# EAGLE design circuit (EAGLE 6.4)
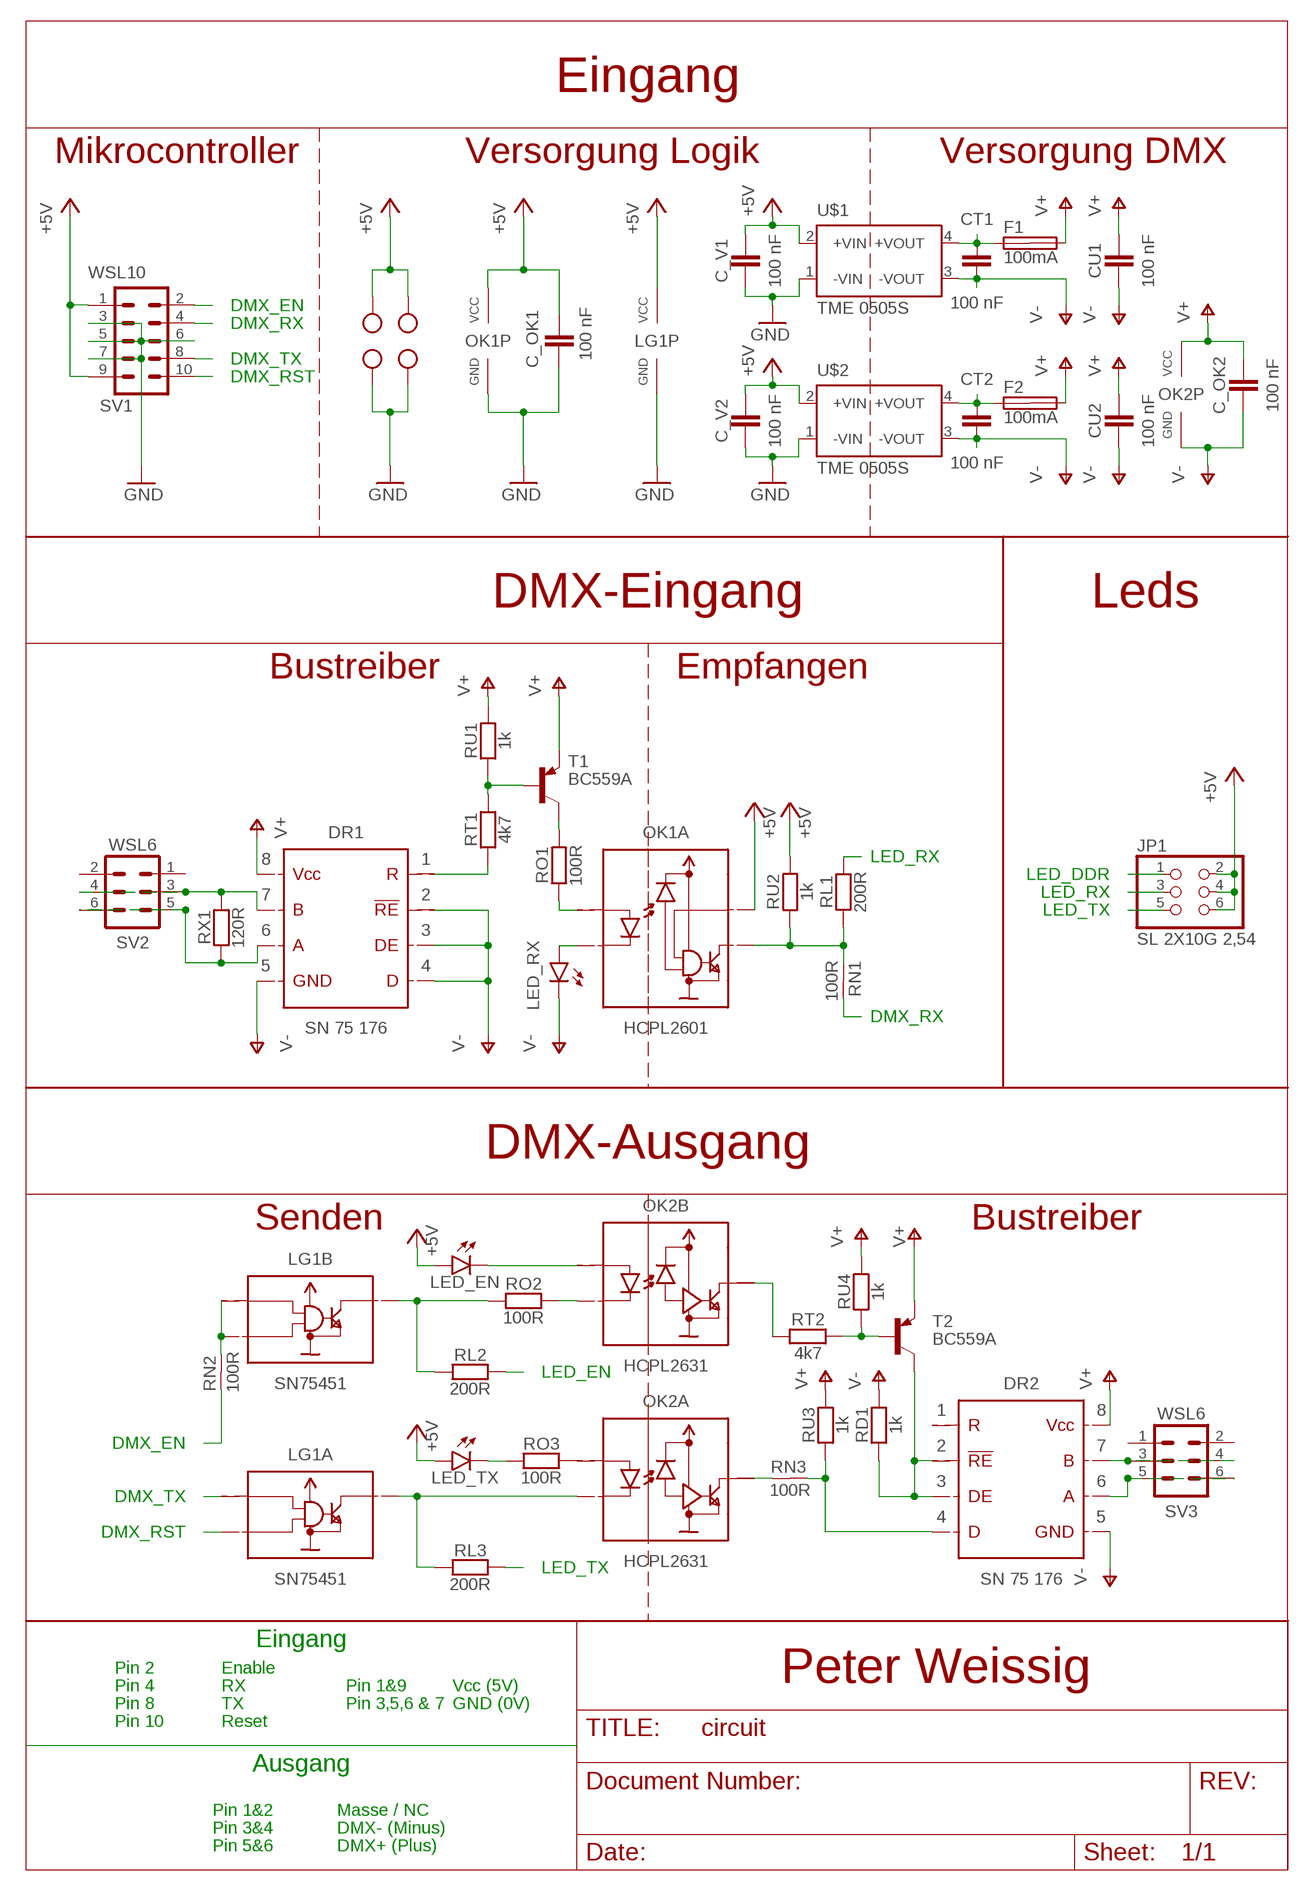
[diagram p0: schematic, sheet 1]

## Parts
C_OK1  100 nF  CAPACITATOR-2,5MM  [C_THT_2]
C_OK2  100 nF  CAPACITATOR-2,5MM  [C_THT_2]
C_V1  100 nF  CAPACITATOR-2,5MM  [C_THT_2]
C_V2  100 nF  CAPACITATOR-2,5MM  [C_THT_2]
CT1  100 nF  CAPACITATOR-2,5MM  [C_THT_2]
CT2  100 nF  CAPACITATOR-2,5MM  [C_THT_2]
CU1  100 nF  CAPACITATOR-2,5MM  [C_THT_2]
CU2  100 nF  CAPACITATOR-2,5MM  [C_THT_2]
DR1  SN75 176  DRIVER_RS485  [IC_DIL08]
DR2  SN75 176  DRIVER_RS485  [IC_DIL08]
F1  100mA  SHK20L  [SHK20L]
F2  100mA  SHK20L  [SHK20L]
JP1  SL 2X10G 2,54  PINHD-2X3  [2X03]
LED_EN  LED-3MM  [LED_3MM]
LED_RX  LED-3MM  [LED_3MM]
LED_TX  LED-3MM  [LED_3MM]
LG1  SN75451  LOGIK_AND_SN75451OUT  [IC_DIL08_OUT]
OK1  HCPL2601  COUPLER_HCPL2601OUT  [IC_DIL08_OUT]
OK2  HCPL2631  COUPLER_HCPL2631OUT  [IC_DIL08_OUT]
RD1  1k  RESISTOR-10MM  [R_THT_4]
RL1  200R  RESISTOR-10MM  [R_THT_4]
RL2  200R  RESISTOR-10MM  [R_THT_4]
RL3  200R  RESISTOR-10MM  [R_THT_4]
RN1  100R  BRIDGE-10MM  [R_THT_4]
RN2  100R  BRIDGE-10MM  [R_THT_4]
RN3  100R  BRIDGE-10MM  [R_THT_4]
RO1  100R  RESISTOR-10MM  [R_THT_4]
RO2  100R  RESISTOR-10MM  [R_THT_4]
RO3  100R  RESISTOR-10MM  [R_THT_4]
RT1  4k7  RESISTOR-10MM  [R_THT_4]
RT2  4k7  RESISTOR-10MM  [R_THT_4]
RU1  1k  RESISTOR-10MM  [R_THT_4]
RU2  1k  RESISTOR-10MM  [R_THT_4]
RU3  1k  RESISTOR-10MM  [R_THT_4]
RU4  1k  RESISTOR-10MM  [R_THT_4]
RX1  120R  RESISTOR-10MM  [R_THT_4]
SV1  WSL10  STECKER_WANNE_10  [STECKER_WANNE_10]
SV2  WSL6  STECKER_WANNE_6  [STECKER_WANNE_6]
SV3  WSL6  STECKER_WANNE_6  [STECKER_WANNE_6]
T1  BC559A  [TO92-EBC]
T2  BC559A  [TO92-EBC]
U$1  TME 0505S  TRACO_TME_1  [TRACO_TME_1]
U$2  TME 0505S  TRACO_TME_1  [TRACO_TME_1]
X1  AKL101-2  W237-102  [W237-102]
X2  AKL101-2  W237-102  [W237-102]

## Nets
+5V: C_OK1.1 C_V1.1 C_V2.1 JP1.2 JP1.4 JP1.6 LED_EN.A LED_TX.A LG1.8(P:VCC) OK1.7(A:I_EN) OK1.8(P:VCC) RU2.2 SV1.1 SV1.9 U$1.2(+VIN) U$2.2(+VIN) X1.1 X2.2
DMX_DDR_1_O1: DR2.2 DR2.3 RD1.2 T2.C
DMX_EN: RN2.2 SV1.2
DMX_N_1: DR1.7 RX1.1 SV2.3 SV2.4
DMX_N_2: DR2.7 SV3.3 SV3.4
DMX_P_1: DR1.6 RX1.2 SV2.5 SV2.6
DMX_P_2: DR2.6 SV3.5 SV3.6
DMX_READ_1_O: DR1.1 RT1.2
DMX_RST: LG1.2(A:I_2) SV1.10
DMX_RX: RN1.1 SV1.4
DMX_TX: LG1.1(A:I_1) SV1.8
GND: C_OK1.2 C_V1.2 C_V2.2 LG1.4(P:GND) OK1.5(P:GND) SV1.3 SV1.5 SV1.6 SV1.7 U$1.1(-VIN) U$2.1(-VIN) X1.2 X2.1
GND_RX: CT1.2 CU1.2 DR1.2 DR1.3 DR1.4 DR1.5 LED_RX.K(C) U$1.3(-VOUT) ; supply symbol labelled V-
GND_TX: C_OK2.1 CT2.2 CU2.2 DR2.5 OK2.5(P:GND) RD1.1 U$2.3(-VOUT) ; supply symbol labelled V-
LED_EN: JP1.1 RL2.2
LED_RX: JP1.3 RL1.1
LED_TX: JP1.5 RL3.2
N$1: OK1.6(A:O) RL1.2 RN1.2 RU2.1
N$2: OK2.6(B:O) RT2.2
N$4: OK2.7(A:O) RN3.2
N$5: DR2.4 RN3.1 RU3.2
N$6: RT1.1 RU1.2 T1.B
N$7: RT2.1 RU4.2 T2.B
N$8: LG1.3(A:O) OK2.2(A:I_K) RL3.1
N$9: OK2.1(A:I_A) RO3.2
N$10: OK2.3(B:I_K) RO2.2
N$11: LED_TX.K(C) RO3.1
N$13: CT1.1 F1.1A U$1.4(+VOUT)
N$15: LG1.5(B:O) RL2.1 RO2.1
N$27: LED_EN.K(C) OK2.4(B:I_A)
N$28: LED_RX.A OK1.3(A:I_K)
N$29: OK1.2(A:I_A) RO1.1
N$30: RO1.2 T1.C
N$39: CT2.1 F2.1A U$2.4(+VOUT)
N$_14: LG1.6(B:I_1) LG1.7(B:I_2) RN2.1
VCC_RX: CU1.1 DR1.8 F1.2A RU1.1 T1.E ; supply symbol labelled V+
VCC_TX: C_OK2.2 CU2.1 DR2.8 F2.2A OK2.8(P:VCC) RU3.1 RU4.1 T2.E ; supply symbol labelled V+
Unconnected: DR2.1 F1.1B F1.2B F2.1B F2.2B SV2.1 SV2.2 SV3.1 SV3.2

## Notes on the sheet
- Eingang
- Mikrocontroller | Versorgung Logik | Versorgung DMX
- DMX_EN
- DMX_RX
- DMX_TX
- DMX_RST
- DMX-Eingang | Leds
- Bustreiber | Empfangen
- LED_RX
- LED_DDR
- LED_RX
- LED_TX
- DMX_RX
- DMX-Ausgang
- Senden | Bustreiber
- LED_EN
- DMX_EN
- DMX_TX
- DMX_RST
- LED_TX
- Eingang
- Pin 2 | Enable
- Peter Weissig
- Pin 4 | RX | Pin 1&9 | Vcc (5V)
- Pin 8 | TX | Pin 3,5,6 & 7 | GND (0V)
- Pin 10 | Reset
- Ausgang
- Pin 1&2 | Masse / NC
- Pin 3&4 | DMX- (Minus)
- Pin 5&6 | DMX+ (Plus)

## Library data of the parts
C_OK1 C_OK2 C_V1 C_V2 CT1 CT2 CU1 CU2 = robo_ag:CAPACITATOR: Kondensator
DR1 DR2 = robo_ag:DRIVER_RS485: RS485-Treiber
F1 F2 = fuse:SHK20L: FUSE HOLDER 5 x 20 mm, SH contact, SHH1 Schukat, E1073 Buerklin; OC_FARNELL: unknown; OC_NEWARK: unknown
JP1 = pinhead:PINHD-2X3: PIN HEADER
LED_EN LED_RX LED_TX = robo_ag:LED: Led
LG1 = robo_ag:LOGIK_AND_SN75451
OK1 = robo_ag:COUPLER_HCPL2601: Optokoppler; REICHELT: HCPL 2601
OK2 = robo_ag:COUPLER_HCPL2631: Optokoppler; REICHELT: HCPL 2631
RD1 RL1-RL3 RO1-RO3 RT1 RT2 RU1-RU4 RX1 = robo_ag:RESISTOR: Widerstand
RN1-RN3 = robo_ag:BRIDGE: Widerstand
SV1 = robo_ag:STECKER_WANNE_10: Stecker; REICHELT: WSL 10G
SV2 SV3 = robo_ag:STECKER_WANNE_6: Stecker; REICHELT: WSL 6G
T1 T2 = transistor-pnp:BC559*: PNP Transistror
U$1 U$2 = robo_ag:TRACO_TME_1
X1 X2 = con-wago-500:W237-102: WAGO SCREW CLAMP; MPN: 237-102; OC_FARNELL: unknown; OC_NEWARK: 70K9898

## Board
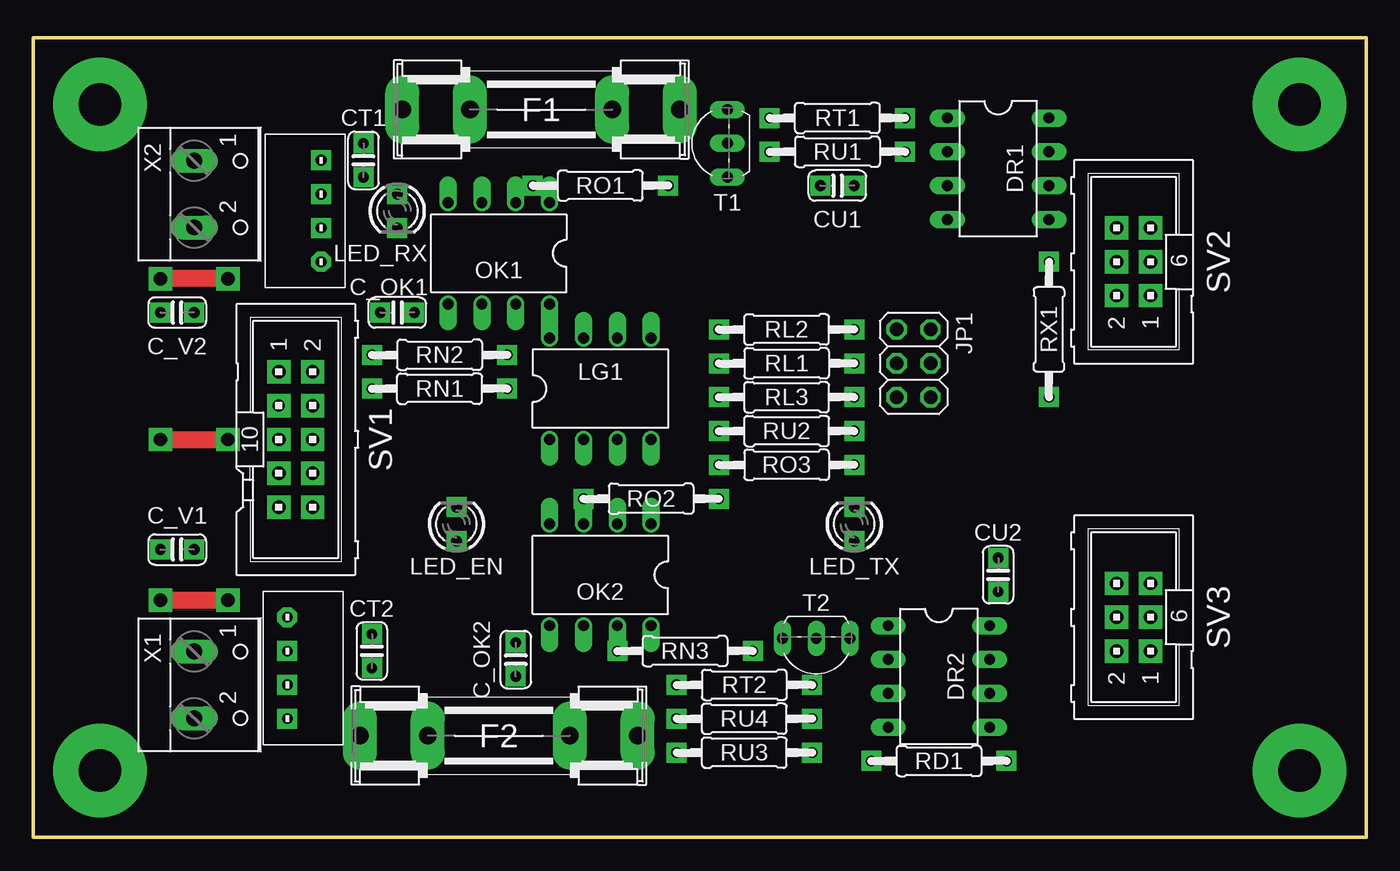
[diagram p1: board, top side]
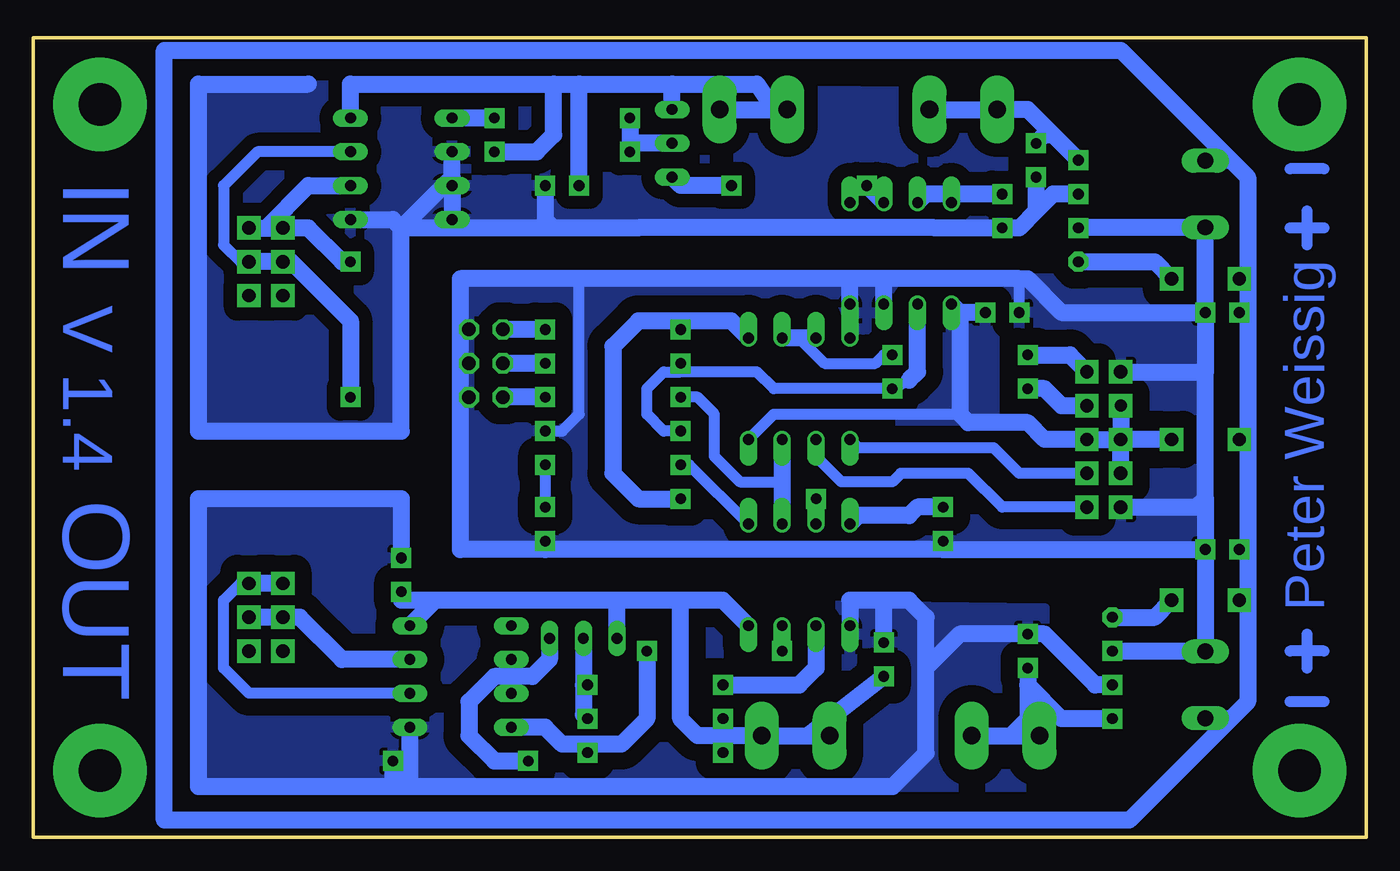
[diagram p2: board, bottom side, seen from below]

Size 100 x 60 mm. Coordinates in mm from the lower left corner, seen from the top.
Outline: 0,0 100,0 100,60 0,60 0,0
Copper layers (1*16): Top 0.035mm / dielectric 1.5mm / Bottom 0.035mm
Design rules "default": minimum track width 10mil, minimum drill 24mil, track to track 8mil, track to pad 8mil, pad to pad 8mil, via to via 8mil, smd to smd 8mil, copper to edge 40mil, drill to drill 8mil, minimum pad ring 10mil, minimum via ring 8mil, stop-mask expansion 4mil, vias tented up to drill 0mil, thermal gap 10mil

### Footprints (pad centres in the part's own frame; a part is rotated, then mirrored left to right if it is on the bottom)
C_THT_2 = drill 0.8 pad 1.5 square: 1 -1.27,0; 2 1.27,0
IC_DIL08 = drill 0.813 long: 1 -3.81,-3.81; 2 -1.27,-3.81; 3 1.27,-3.81; 4 3.81,-3.81; 5 3.81,3.81; 6 1.27,3.81; 7 -1.27,3.81; 8 -3.81,3.81
SHK20L = drill 1.321 pad 2.54 long: 1A -10.414,0; 1B -5.334,0; 2A 10.414,0; 2B 5.334,0
2X03 = drill 1.016 octagon: 1 -2.54,-1.27; 2 -2.54,1.27; 3 0,-1.27; 4 0,1.27; 5 2.54,-1.27; 6 2.54,1.27
LED_3MM = drill 0.8 pad 1.5 square: A -1.27,0; K 1.27,0
IC_DIL08_OUT = drill 0.813 offset: 1 -3.81,-3.81; 2 -1.27,-3.81; 3 1.27,-3.81; 4 3.81,-3.81; 5 3.81,3.81; 6 1.27,3.81; 7 -1.27,3.81; 8 -3.81,3.81
R_THT_4 = drill 0.8 pad 1.5 square: 1 -5.08,0; 2 5.08,0
STECKER_WANNE_10 = drill 1 pad 1.75 square: 1 -5.08,-1.27; 2 -5.08,1.27; 4 -2.54,1.27; 5 0,-1.27; 6 0,1.27; 7 2.54,-1.27; 8 2.54,1.27; 9 5.08,-1.27; 10 5.08,1.27 | drill 0.914 pad 1.75 square: 3 -2.54,-1.27
STECKER_WANNE_6 = drill 1 pad 1.75 square: 1 -2.54,-1.27; 2 -2.54,1.27; 3 0,-1.27; 4 0,1.27; 5 2.54,-1.27; 6 2.54,1.27
TO92-EBC = drill 0.813 long: B 0,-1.27; C -2.54,-1.27; E 2.54,-1.27
TRACO_TME_1 = drill 0.8 pad 1.5 octagon: 1 -3.81,0 | drill 0.8 pad 1.5 square: 2 -1.27,0; 3 1.27,0; 4 3.81,0
W237-102 = drill 1.194 long: 1 -2.5,-1.27; 2 2.5,-1.27

### Placement (x,y rotation side)
C_OK1  27.3,39.37 0 top
C_OK2  36.2,13.34 270 top
C_V1  10.79,21.59 180 top
C_V2  10.79,39.37 180 top
CT1  24.77,50.8 270 top
CT2  25.4,13.97 90 top
CU1  60.33,48.9 0 top
CU2  72.39,19.68 90 top
DR1  72.39,50.16 270 top
DR2  67.94,12.06 270 top
F1  38.1,54.61 0 top
F2  34.92,7.62 0 top
JP1  66.04,35.56 270 top
LED_EN  31.75,23.5 90 top
LED_RX  27.3,46.99 270 top
LED_TX  61.59,23.5 90 top
LG1  42.55,33.66 0 top
OK1  34.92,43.81 180 top
OK2  42.55,19.68 180 top
RD1  67.94,5.71 180 top
RL1  56.52,35.56 180 top
RL2  56.52,38.1 0 top
RL3  56.52,33.02 0 top
RN1  30.48,33.66 0 top
RN2  30.48,36.2 180 top
RN3  48.9,13.97 180 top
RO1  42.55,48.9 0 top
RO2  46.35,25.4 180 top
RO3  56.52,27.94 180 top
RT1  60.33,53.98 0 top
RT2  53.34,11.43 180 top
RU1  60.33,51.44 180 top
RU2  56.52,30.48 0 top
RU3  53.34,6.35 0 top
RU4  53.34,8.89 0 top
RX1  76.2,38.1 90 top
SV1  19.68,29.84 270 top
SV2  82.55,43.18 90 top
SV3  82.55,16.51 90 top
T1  50.8,52.07 90 top
T2  58.74,13.65 180 top
U$1  21.59,46.99 90 top
U$2  19.05,12.7 270 top
X1  13.34,11.43 270 top
X2  13.34,48.26 270 top

### Tracks (layer width: path | path; a pad name or v marks a point on that pad's centre or on a via)
+5V
  Bottom 0.813: C_OK1.1 26.04,41.91 | 59.05,41.91 59.05,31.75 60.33,30.48 RU2.2 | LED_TX.A 61.59,21.59
  Bottom 1.27: 36.2,41.91 26.04,41.91 25.4,41.91 22.86,39.37 C_V2.1 | 36.2,41.91 38.73,41.91 | 38.73,41.91 59.05,41.91 67.94,41.91 67.94,38.1 | 67.94,33.02 67.94,21.59 61.59,21.59 31.75,21.59 | 67.94,33.02 67.94,35.56 | 67.94,35.56 67.94,38.1 | JP1.2 67.94,38.1 | JP1.4 67.94,35.56 | JP1.6 67.94,33.02 | OK1.7 36.2,41.91 | 38.73,41.91 OK1.8 LG1.8 | 31.75,21.59 C_V1.1 | LED_EN.A 31.75,21.59 | U$2.2 19.01,13.93 X1.1 C_V1.1 | 12.06,25.4 12.06,34.92 | SV1.1 12.06,34.92 | SV1.9 12.7,24.77 12.06,25.4 | 12.06,25.4 C_V1.1 | C_V2.1 12.06,34.92 | C_V2.1 X2.2 21.55,45.76 U$1.2
  pour Bottom (isolate 1.27): 12.7,41.91 12.7,21.59 67.94,21.59 67.94,41.91
DMX_DDR_1_O1
  Bottom 1.27: DR2.2 64.14,12.06 | 64.14,12.06 DR2.3 | T2.C 61.28,13.34 62.55,12.06 64.14,12.06 | 64.14,12.06 65.41,12.06 67.31,10.16 67.31,7.62 65.41,5.71 RD1.2
DMX_EN
  Bottom 1.27: RN2.2 22.23,36.2 SV1.2
DMX_N_1
  Bottom 0.813: 83.19,43.18 84.45,43.18 85.72,44.45 85.72,48.9 83.19,51.44 DR1.7
  Bottom 1.27: SV2.3 83.19,43.18 SV2.4 80.64,43.18 76.2,38.73 RX1.1
DMX_N_2
  Bottom 1.27: DR2.7 76.83,13.34 80.01,16.51 SV3.4 SV3.3
DMX_P_1
  Bottom 1.27: SV2.5 82.55,45.72 | 82.55,45.72 SV2.6 79.38,45.72 76.83,43.18 RX1.2 | 82.55,45.72 79.38,48.9 DR1.6
DMX_P_2
  Bottom 0.813: SV3.5 84.45,19.05 85.72,17.78 85.72,12.7 83.82,10.79 DR2.6
  Bottom 1.27: SV3.6 SV3.5
DMX_READ_1_O
  Bottom 1.27: RT1.2 DR1.1
DMX_RST
  Bottom 0.813: LG1.2 41.27,28.57 39.37,26.67 35.56,26.67 34.92,27.3 29.84,27.3 27.3,24.77 SV1.10
DMX_RX
  Bottom 1.27: RN1.1 24.13,33.66 22.86,32.38 SV1.4
DMX_TX
  Bottom 0.813: SV1.8 26.04,27.3 27.94,29.21 38.1,29.21 LG1.1
GND  (via drill 1 pad 1.75)
  Top 1.27: v14.61,41.91 v9.53,41.91 | v14.61,17.78 v9.53,17.78 | v9.53,29.84 v14.61,29.84
  Bottom 0.813: LG1.4 44.45,31.75 30.48,31.75
  Bottom 1.27: C_OK1.2 30.48,39.37 | 30.48,39.37 OK1.5 | 30.48,39.37 30.48,31.75 29.84,31.11 25.4,31.11 24.13,29.84 SV1.6 SV1.5 | SV1.3 SV1.5 | SV1.7 SV1.5 | 10.16,8.89 17.78,1.27 90.17,1.27 90.17,59.05 18.41,59.05 10.16,50.8 | X1.2 10.2,8.93 10.16,8.89 | 8.89,41.91 8.89,49.53 10.16,50.8 | 8.89,41.91 8.89,39.37 | 8.89,39.37 8.89,29.84 | 8.89,29.84 8.89,21.59 | 8.89,21.59 8.89,17.78 | 8.89,17.78 8.89,10.16 10.16,8.89 | U$1.1 15.88,43.18 v14.61,41.91 | U$2.1 15.88,16.51 v14.61,17.78 | C_V2.2 8.89,39.37 | C_V1.2 8.89,21.59 | v9.53,41.91 8.89,41.91 | v9.53,17.78 8.89,17.78 | 8.89,29.84 v9.53,29.84 | v14.61,29.84 SV1.5 | X2.1 12.03,50.8 10.16,50.8
  pour Bottom (isolate 1.27): 34.92,39.37 27.94,39.37 27.94,29.21 34.92,29.21
GND_RX
  Bottom 1.27: 72.39,45.72 72.39,30.48 87.63,30.48 87.63,56.52 79.38,56.52 | 60.96,45.72 54.61,45.72 54.6,45.73 32.39,45.73 32.38,45.72 LED_RX.K 26.04,45.72 24.77,46.99 | 60.96,45.72 72.39,45.72 | DR1.5 73.03,46.35 72.39,45.72 | 68.58,49.53 DR1.3 DR1.4 | 68.58,49.53 DR1.2 | 72.39,45.72 68.58,49.53 | CU1.2 61.59,46.35 60.96,45.72 | U$1.3 23.5,48.26 24.77,46.99 | CT1.2 24.77,46.99
  pour Bottom (isolate 1.016): 27.3,55.88 27.3,45.72 72.39,45.72 72.39,30.48 87.63,30.48 87.63,56.52
GND_TX
  Bottom 1.27: 73.03,3.81 87.63,3.81 87.63,25.4 72.39,25.4 CU2.2 | 73.03,3.81 71.75,3.81 | 71.75,3.81 35.52,3.81 33.02,6.31 33.02,12.7 | 33.02,12.7 33.02,16.51 34.29,17.78 36.2,17.78 | RD1.1 73.03,3.81 | DR2.5 71.75,3.81 | 36.2,17.78 38.73,17.78 OK2.5 | C_OK2.1 36.2,17.78 | U$2.3 20.32,11.43 24.13,15.24 CT2.2 30.48,15.24 33.02,12.7
  pour Bottom (isolate 1.27): 24.13,17.14 72.39,17.78 72.39,25.4 87.63,25.4 87.63,3.81 24.13,3.81
LED_EN
  Bottom 1.27: RL2.2 JP1.1
LED_RX
  Bottom 1.27: RL1.1 JP1.3
LED_TX
  Bottom 1.27: RL3.2 JP1.5
N$1
  Bottom 0.813: 34.29,34.29 RN1.2 44.45,33.66 45.72,34.92 51.44,34.92 | RU2.1 52.7,30.48 53.98,31.75 53.98,33.66 52.7,34.92 51.44,34.92 | 51.44,34.92 RL1.2
  Bottom 1.27: 34.29,34.29 33.66,34.92 33.66,39.37 OK1.6
N$2
  Bottom 1.27: OK2.6 41.27,12.7 42.55,11.43 RT2.2
N$3
  Bottom 0.813: 3.17,45.72 5.71,45.72
N$4
  Bottom 0.813: RN3.2 OK2.7
N$5
  Bottom 0.813: RU3.2 58.42,6.99
  Bottom 1.27: RN3.1 53.98,8.89 55.88,6.99 58.42,6.99 60.33,6.99 61.59,8.26 DR2.4
N$6
  Bottom 1.27: RT1.1 55.24,52.07 | 55.24,52.07 RU1.2 | T1.B 55.24,52.07
N$7
  Bottom 1.27: T2.B 58.74,11.43 | 58.74,11.43 58.74,9.21 RU4.2 | RT2.1 58.74,11.43
N$8
  Bottom 0.813: 43.81,26.67 46.99,26.67 48.9,28.57 48.9,31.75 50.16,33.02 RL3.1
  Bottom 1.27: LG1.3 43.81,26.67 OK2.2
N$9
  Bottom 0.813: OK2.1 50.8,27.94 RO3.2
N$10
  Bottom 1.27: OK2.3 RO2.2
N$11
  Bottom 0.813: RO3.1 LED_TX.K
N$12  (via drill 3.2 pad 7)
  other vias: 5,55
N$13
  Bottom 1.27: 33.02,54.61 F1.1A 25.4,54.61 23.5,52.7 | U$1.4 23.5,52.7 | CT1.1 24.13,52.7 23.5,52.7
N$15
  Bottom 1.27: LG1.5 47.62,38.73 51.44,38.73 | RL2.1 51.44,38.73 | 51.44,38.73 54.61,38.73 56.52,36.83 56.52,27.3 54.61,25.4 RO2.1
N$19  (via drill 3.2 pad 7)
  other vias: 5,5
N$21  (via drill 3.2 pad 7)
  other vias: 95,5
N$22  (via drill 3.2 pad 7)
  other vias: 95,55
N$24
  Bottom 0.813: 4.45,46.99 4.45,44.45
N$25
  Bottom 0.813: 3.17,50.16 5.71,50.16
N$27
  Bottom 1.27: LED_EN.K 33.66,24.77 34.29,24.13 38.1,24.13 OK2.4
N$28
  Bottom 1.27: LED_RX.A 33.02,48.26 OK1.3
N$29
  Bottom 1.27: OK1.2 RO1.1
N$30
  Bottom 1.27: RO1.2 51.44,48.9 T1.C
N$39
  Bottom 1.27: 29.84,7.62 26.67,7.62 | 26.67,7.62 F2.1A | 26.67,7.62 25.4,8.89 25.4,11.43 | CT2.1 25.4,11.43 | U$2.4 22.86,8.89 25.4,11.43
N$42
  Bottom 0.813: 4.45,15.24 4.45,12.7
N$43
  Bottom 0.813: 3.17,10.16 5.71,10.16
N$44
  Bottom 0.813: 3.17,13.97 5.71,13.97
N$_14
  Bottom 0.813: 42.55,37.47 40.64,35.56 36.83,35.56 36.2,36.2 RN2.1
  Bottom 1.27: LG1.7 42.55,37.47 LG1.6
VCC_RX
  Bottom 1.27: F1.2A 44.45,54.61 | 44.45,54.61 45.72,56.52 52.07,56.52 | T1.E 52.07,56.52 | DR1.8 76.2,56.52 60.96,56.52 | 60.96,56.52 59.05,56.52 | 59.05,56.52 52.07,56.52 | 60.96,56.52 60.96,52.7 62.23,51.44 RU1.1 | CU1.1 59.05,56.52 | 44.45,54.61 43.18,54.61
VCC_TX
  Bottom 1.27: 51.44,17.78 48.26,17.78 OK2.8 | 51.44,17.78 56.2,17.78 | 56.2,17.78 69.85,17.78 | 69.85,17.78 72.39,17.78 CU2.1 | 41.91,7.62 F2.2A 48.26,7.62 | 41.91,7.62 40.01,7.62 | RU3.1 48.26,7.62 | 48.26,7.62 50.16,7.62 51.44,8.89 51.44,17.78 | T2.E 56.2,17.78 | RU4.1 48.26,7.62 | DR2.8 69.85,17.78 | C_OK2.2 41.91,7.62

### Text on the board
Bottom: IN | V 1.4 | Peter Weissig | OUT